# Altium schematic sheet rev_polarity_protection.SchDoc
size A4; SheetNumber: 1; SheetTotal: 1
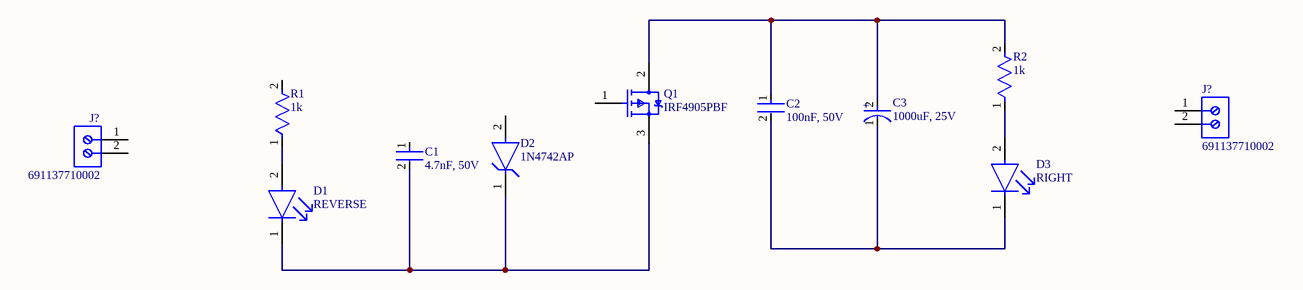
[diagram p0: rev_polarity_protection.SchDoc]

## Parts
(Parts that share a designator on the sheet are numbered #1, #2 ... from top to bottom, then left to right.)
C1  4.7nF, 50V  [FP-C0805C-DN-MFG]
C2  100nF, 50V  [FP-0805B-IPC_C]
C3  1000uF, 25V  [FP-RAD-TH-D_12_5_0_5-L_20-MFG]
D1  REVERSE  [FP-LTL-1CHEE-MFG]
D2  1N4742AP  [FP-1N4742APE3-TR8-MFG]
D3  RIGHT  [FP-6_544-5255_01-4-MFG]
J?#1  691137710002  [691137710002]
J?#2  691137710002  [691137710002]
Q1  IRF4905PBF  [FP-PG-TO220-3-MFG]
R1  1k  [FP-FMP100-MFG]
R2  1k  [FP-FMP100-MFG]

## Nets
NetC1_2: C1.2 D1.1(C) D2.1(C) Q1.3(SOURCE)
NetC2_1: C2.1 C3.2(A) Q1.2(DRAIN) R2.2
NetC2_2: C2.2 C3.1(C) D3.1(C)
NetD1_2: D1.2(A) R1.1
NetD3_2: D3.2(A) R2.1

Not connected (* = marked no-connect by the designer): C1 1; D2 2(A); J?#1 1 2; J?#2 1 2; Q1 1(GATE); R1 2

## Notes on the sheet
- (in symbol CMP-05427-000606-1) +

## Library data of the parts
C1 = CMP-03020-025139-1: CAP CER 4700PF 50V X7R 0805; Manufacturer Part Number: C0805C472K5RACTU; Manufacturer: KEMET; Value: 4,700 pF; Material: Ceramic; Tolerance: 0.1; Description: C0805 4,700 pF X7R 30ppm/°C 10.00% 50 V; Temperature Coefficient: 30ppm/°C; Temperature Characteristic: X7R; Temperature Range Low: -55°C; Device Class L1: Passive Components; Lead Free: Yes; Category: Cap; ComponentLink2Description: Datasheet; ComponentLink2URL: https://content.kemet.com/datasheets/KEM_C1003_C0G_SMD.pdf; Device Class L3: Ceramic Capacitors; Digikey Description: CAP CER 4700PF 50V X7R 0805; RoHS: TRUE; Temperature Range High: +125°C; Voltage Rating: 50 V; Mouser Description: Cap Ceramic 0.0047uF 50V X7R 10% SMD 0805 125°C Paper T/R; Octopart: https://octopart.com/c0805c472k5ractu-kemet-86501; Automotive: No; Package: C0805C-DN; Capacitance: 4,700 pF; Height: 0.88mm; Device Class L2: Capacitors; Temperature: -55°C to +125°C; Ipc Land Pattern Name: CAPC200125X78
C2 = CMP-45632-000003-1: CAP CER 0.1UF 50V X7R 0805; Tolerance: 10%; RoHS Compliant: Yes; Packaging: Tape and Reel; Voltage Rating (DC): 50V; Voltage Rating: 50V; Capacitance: 100nF; Length: 2mm; Lead Free: Lead Free; Voltage: 50V; Case/Package: 0805; Case Code (Metric): 2012; Depth: 1.25mm; Min Operating Temperature: -55°C; Case Code (Imperial): 0805; Max Operating Temperature: 125°C; Radiation Hardening: No; Dielectric: X7R
C3 = CMP-05427-000606-1: Aluminum Electrolytic Capacitors (Radial Lead Type) 1000uF ±20% 25V; Lead Length: 17mm; ESR (Equivalent Series Resistance): 18mR; Dissipation Factor: 0.14%; Lead Diameter: 0.6mm; Dielectric Material: Aluminium; Capacitance: 1mF; Life (Hours): 5000Hour; Ripple Current: 2.6A; Contact Plating: Tin; Voltage: 25V; Length: 20mm; Packaging: Bulk; RoHS Compliant: Yes; REACH SVHC: Yes; Lead Free: Lead Free; Tolerance: 20%; Features: General Purpose; Construction: RADIAL; Lead Pitch: 5mm; Impedance: 18mR; Min Operating Temperature: -40°C; Case/Package: Radial; Diameter: 12.5mm; Height - Seated (Max): 0.787inch; Package Quantity: 200; Mount: Through Hole; Max Operating Temperature: 105°C; Series: FM; Height: 20mm; Voltage Rating (DC): 25V; Termination: Radial; Voltage Rating: 25V; Radiation Hardening: No
D1 = CMP-22017-000040-1: LED RED CLEAR T/H; Viewing Angle: 45°; Power Dissipation: 100mW; Wavelength: 635nm; Number of LEDs: 1; Test Current: 10mA; Lens Style: Dome; Forward Current: 30mA; Forward Voltage: 2V; Luminous Intensity: 19mcd; Reverse Voltage: 5V; Dominant Wavelength: 625nm; RoHS Compliant: Yes; Mount: Through Hole; Diameter: 3.1mm; Package Quantity: 1000; Lens Transparency: Clear; Illumination Color: Red; Lens Color: Red; Max Operating Temperature: 100°C; Radiation Hardening: No; Case/Package: T; Width: 3.8mm; Length: 3.8mm; Depth: 3.8mm; Series: -; Number of Pins: 2; Number of Elements: 1; Height: 5.2mm; Max Power Dissipation: 100mW; Lead Free: Lead Free; Packaging: Bulk; Color: Red; Min Operating Temperature: -55°C
D2 = CMP-06360-000055-1: DIODE ZENER 12V 1W DO204AL
D3 = CMP-02520-000017-1: LED GREEN DIFFUSED T-1 T/H; Number of Elements: 1; Forward Voltage: 2.4V; Luminous Intensity: 2mcd; Reverse Voltage: 20V; Power Dissipation: 20mW; Dominant Wavelength: 575nm; Forward Current: 7mA; Viewing Angle: 50°; Test Current: 2mA; Number of Pins: 2; Lens Style: Diffused; Color: Green; Case/Package: T; Depth: 3.2mm; Length: 3.2mm; Number of LEDs: 1; Mount: Through Hole; Radiation Hardening: No; Max Operating Temperature: 100°C; RoHS Compliant: No; Min Operating Temperature: -40°C; Packaging: Tape and Reel
J?#1 J?#2 = CMP-1502-03324-3: Terminal Block, 5MM Pitch, Horizontal, Pressure Clamp Glow Wire, Pcb, 2PINS, Gr; Current Rating: 16A; Number of Contacts: 2; Voltage Rating: 300V; Number of Pins: 2; Min Operating Temperature: -30°C; Lead Pitch: 5mm; Packaging: Box; Max Operating Temperature: 120°C; RoHS: Compliant; Number of Rows: 1; Height: 11.6mm; Contact Material: Nickel, Tin
Q1 = CMP-32901-000200-1: MOSFET P-CH 55V 74A TO-220AB; Drain to Source Resistance: 20mR; Input Capacitance: 3.4nF; Max Dual Supply Voltage: -55V; Power Dissipation: 200W; Turn-On Delay Time: 18ns; Element Configuration: Single; Threshold Voltage: -4V; Gate to Source Voltage (Vgs): 20V; Turn-Off Delay Time: 61ns; Number of Pins: 3; Packaging: Rail/Tube; RoHS Compliant: Yes; REACH SVHC: No SVHC; Halogen Free: Halogen Free; Max Power Dissipation: 200W; Drain to Source Breakdown Voltage: -55V; Length: 0.414inch; Drain to Source Voltage (Vdss): -55V; Height: 0.6inch; Case/Package: TO-220; Width: 0.185inch; Continuous Drain Current (ID): 74A; Mount: Through Hole; Min Operating Temperature: -55°C; Lead Free: Lead Free; Max Operating Temperature: 175°C; Rds On Max: 20mR
R1 R2 = CMP-00621-25629781-1: Resistor, 1 kOhm, ± 5%, 1 W, Axial Leaded, Metal Film, High Power Flame Proof; Power Rating: 1W; Resistance: 1kΩ; Temperature Coefficient: 100ppm/°C; Length: 6.3mm; Min Operating Temperature: -55°C; Tolerance: 5%; RoHS: Compliant; Military Standard: Not; Mount: Through Hole; Case/Package: Conformal; Diameter: 2.4mm; Schedule B: 8533210090, 8533210090; Radiation Hardening: No; Lead Free: Lead Free; Composition: Metal Film; Max Operating Temperature: 155°C; Termination: Axial